# EasyEDA schematic SCH_CANSAT-M2-2026.json

## Sheets
1 Sensors: TITLE: Sensors; REV: 1.0; Date: 2026-02-06; Sheet: 1/1; Drawn By: Engineer162
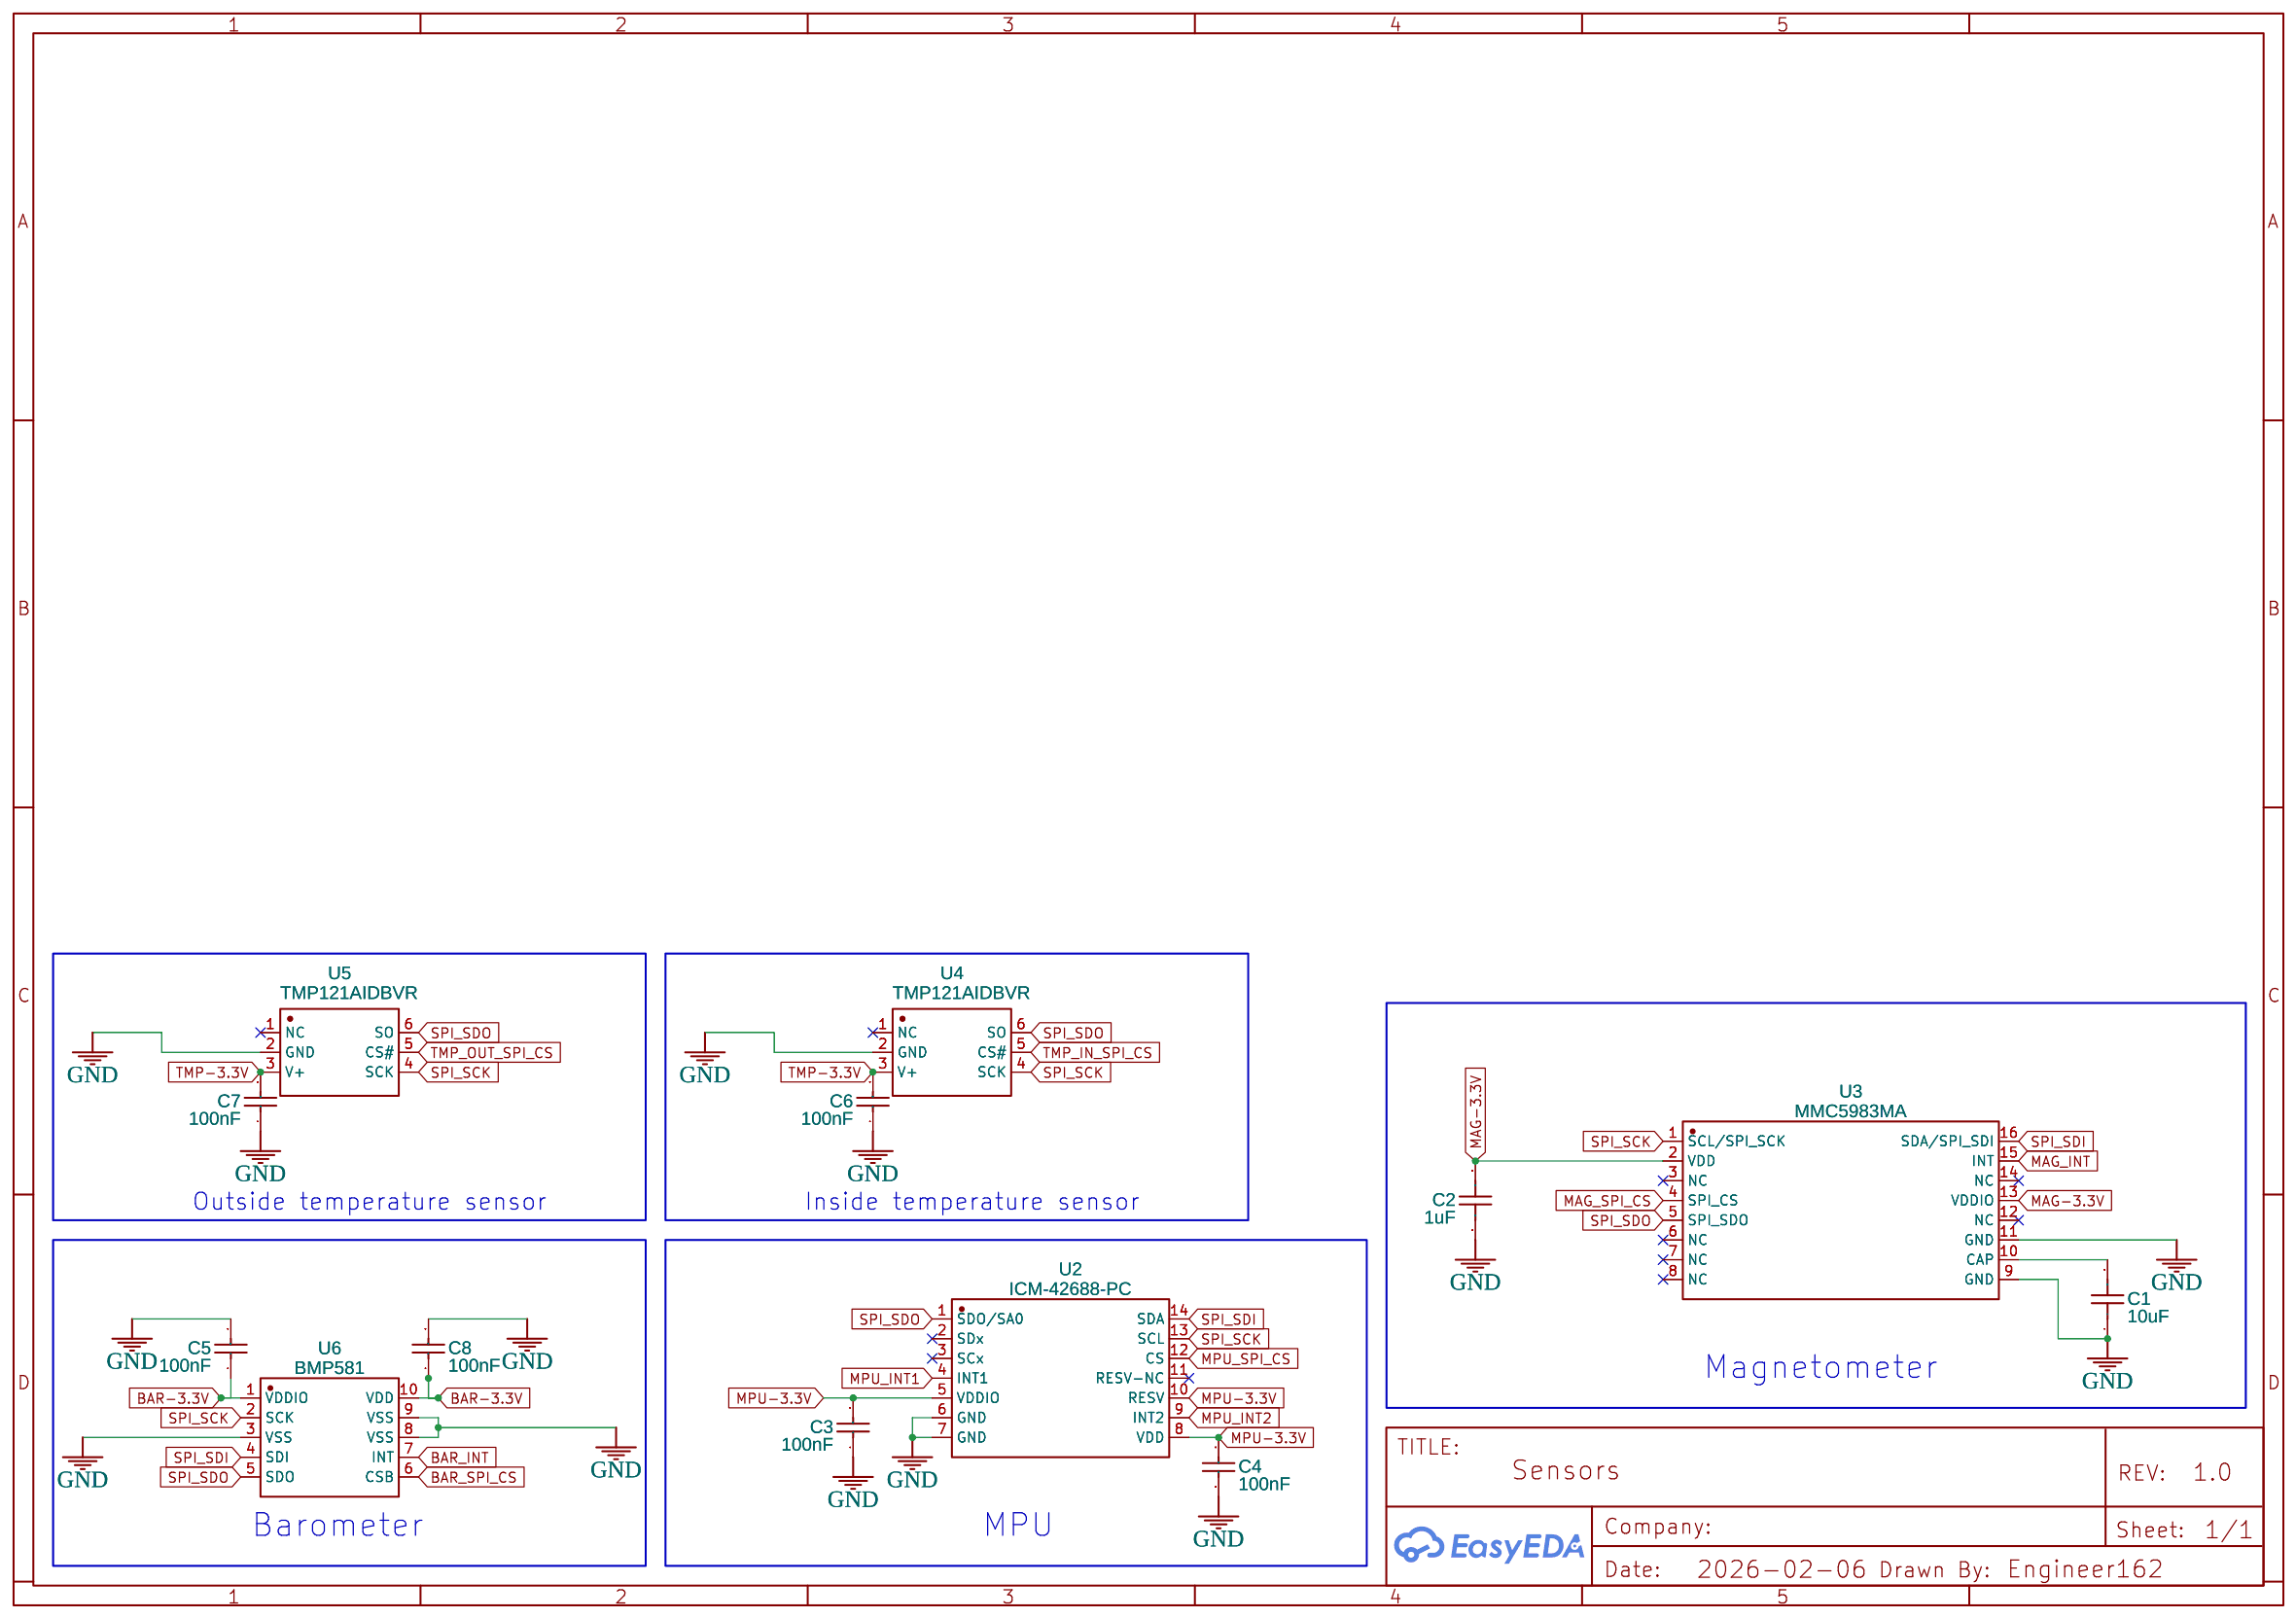
[diagram p0: Sensors]
2 Battery: TITLE: Battery
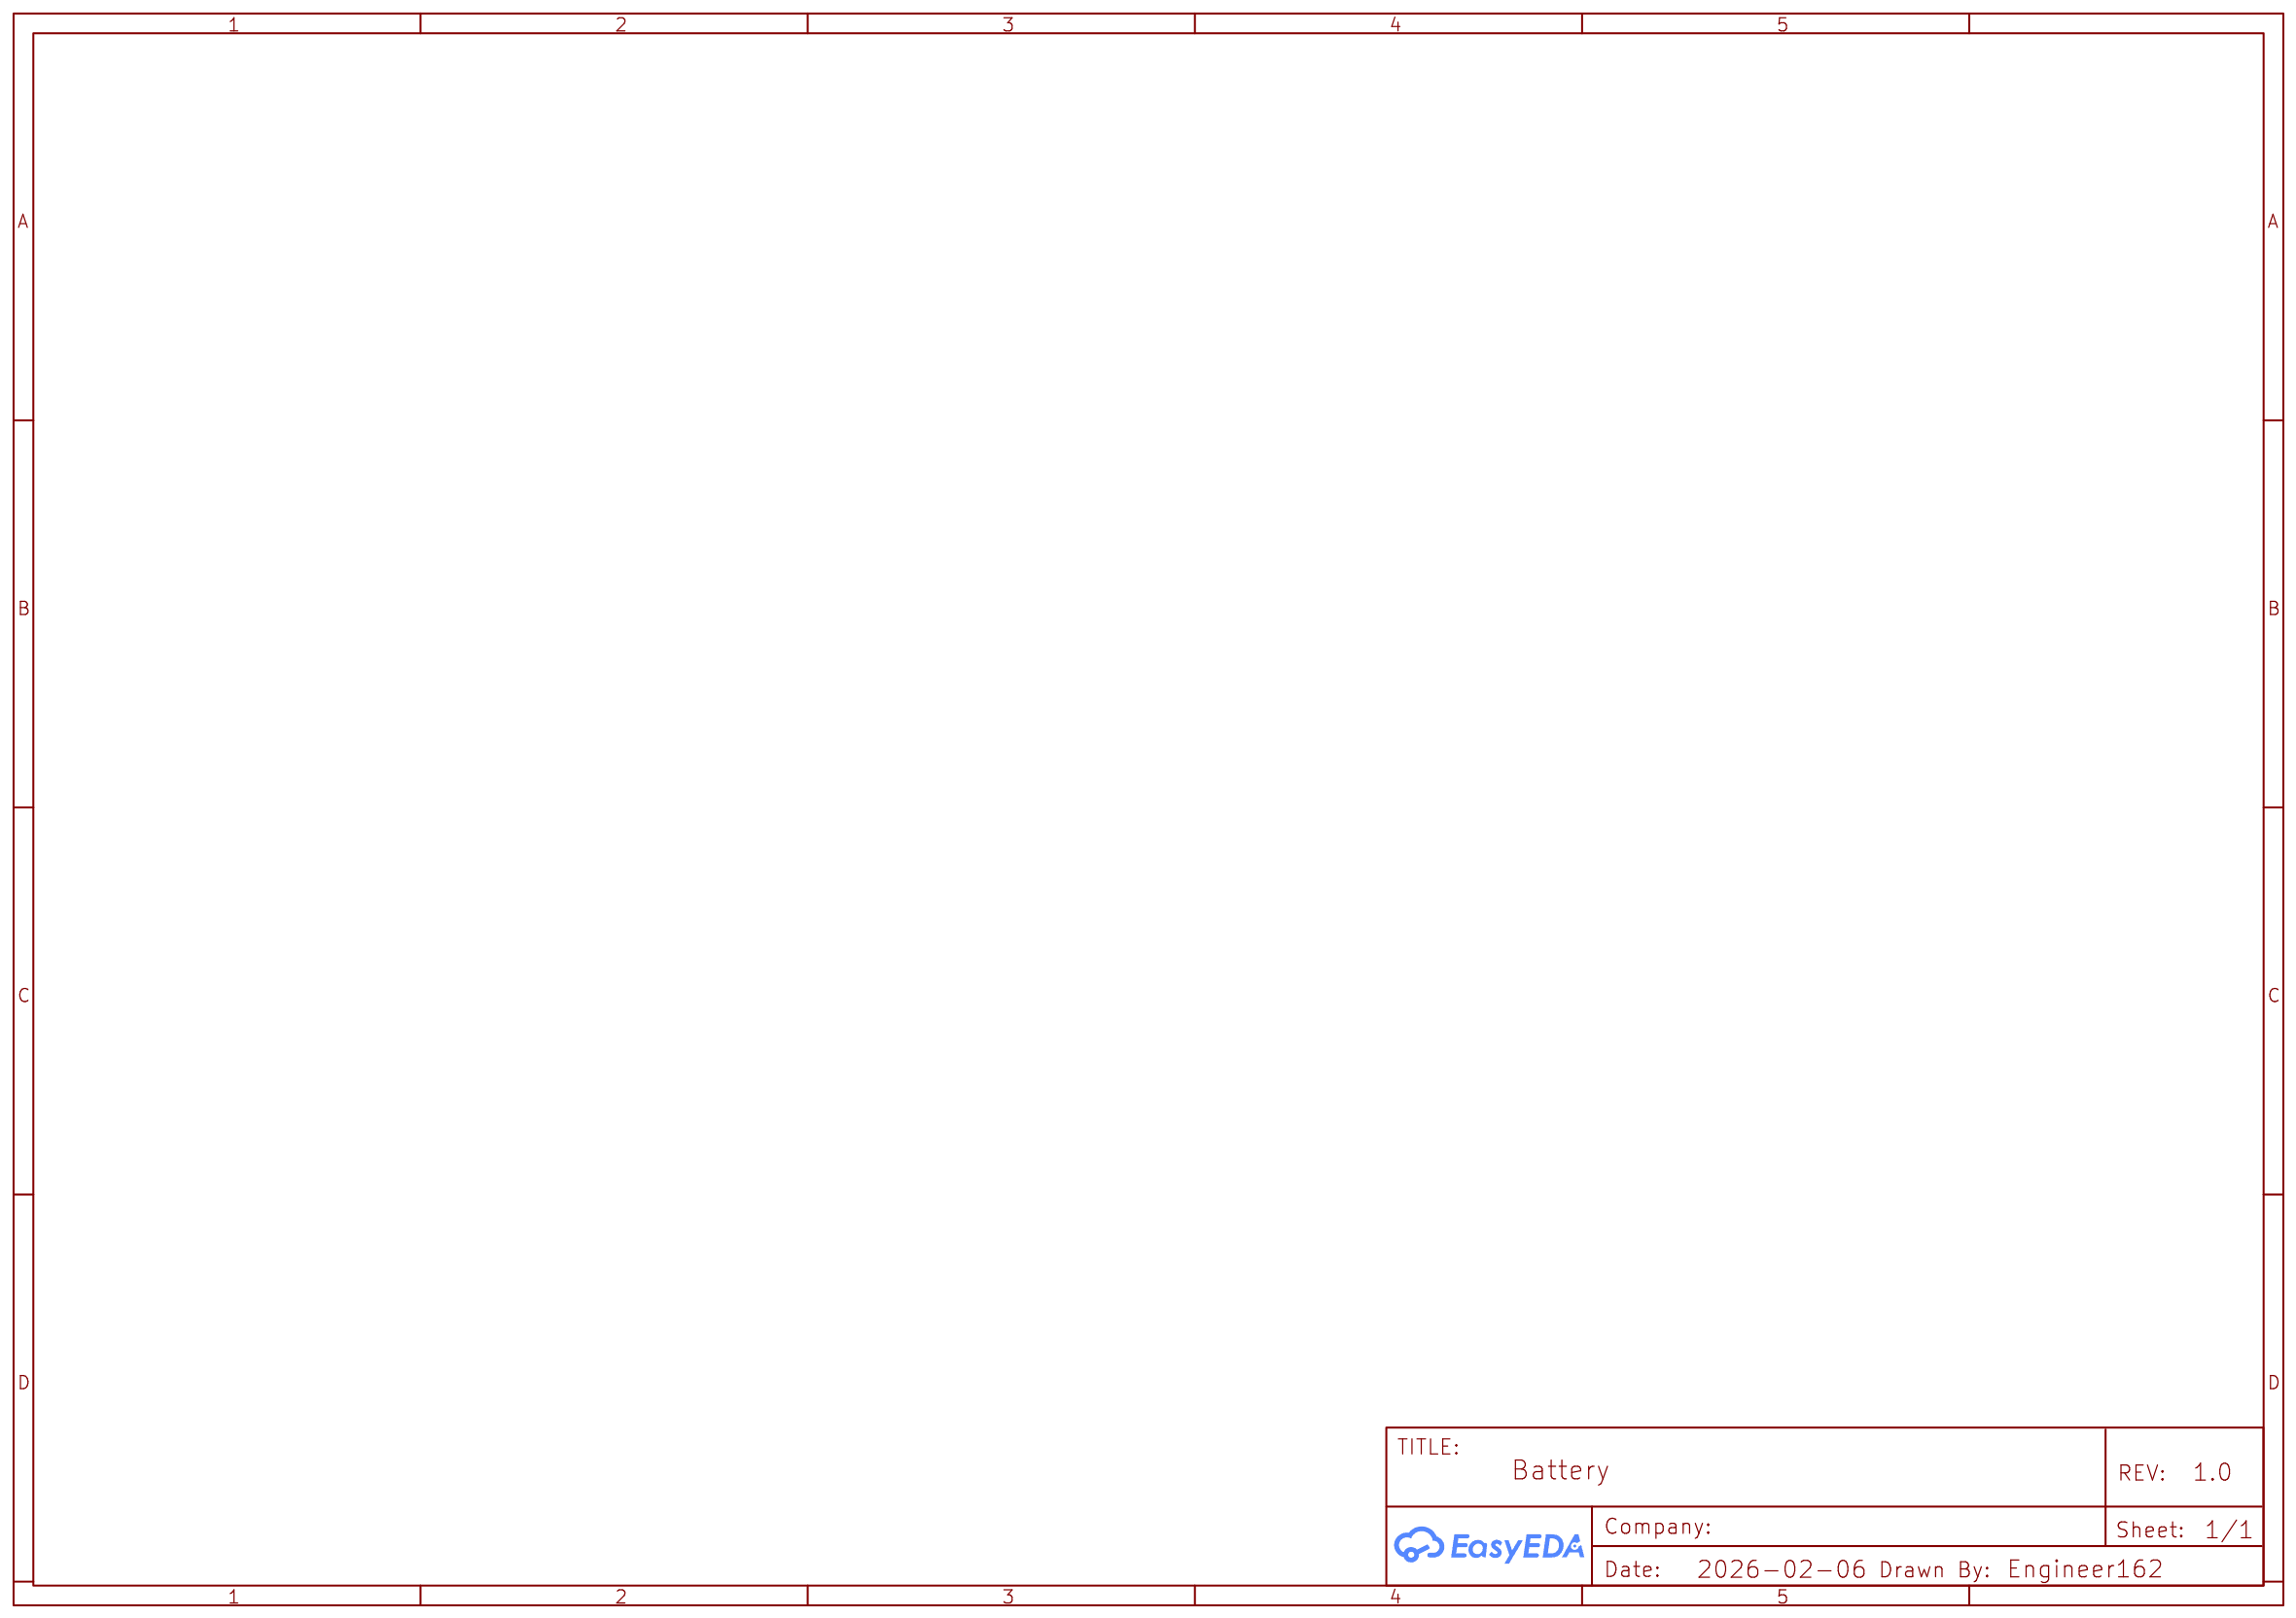
[diagram p1: Battery]
3 MCU: TITLE: MCU; Drawn By: hjalte; Company: Your Company
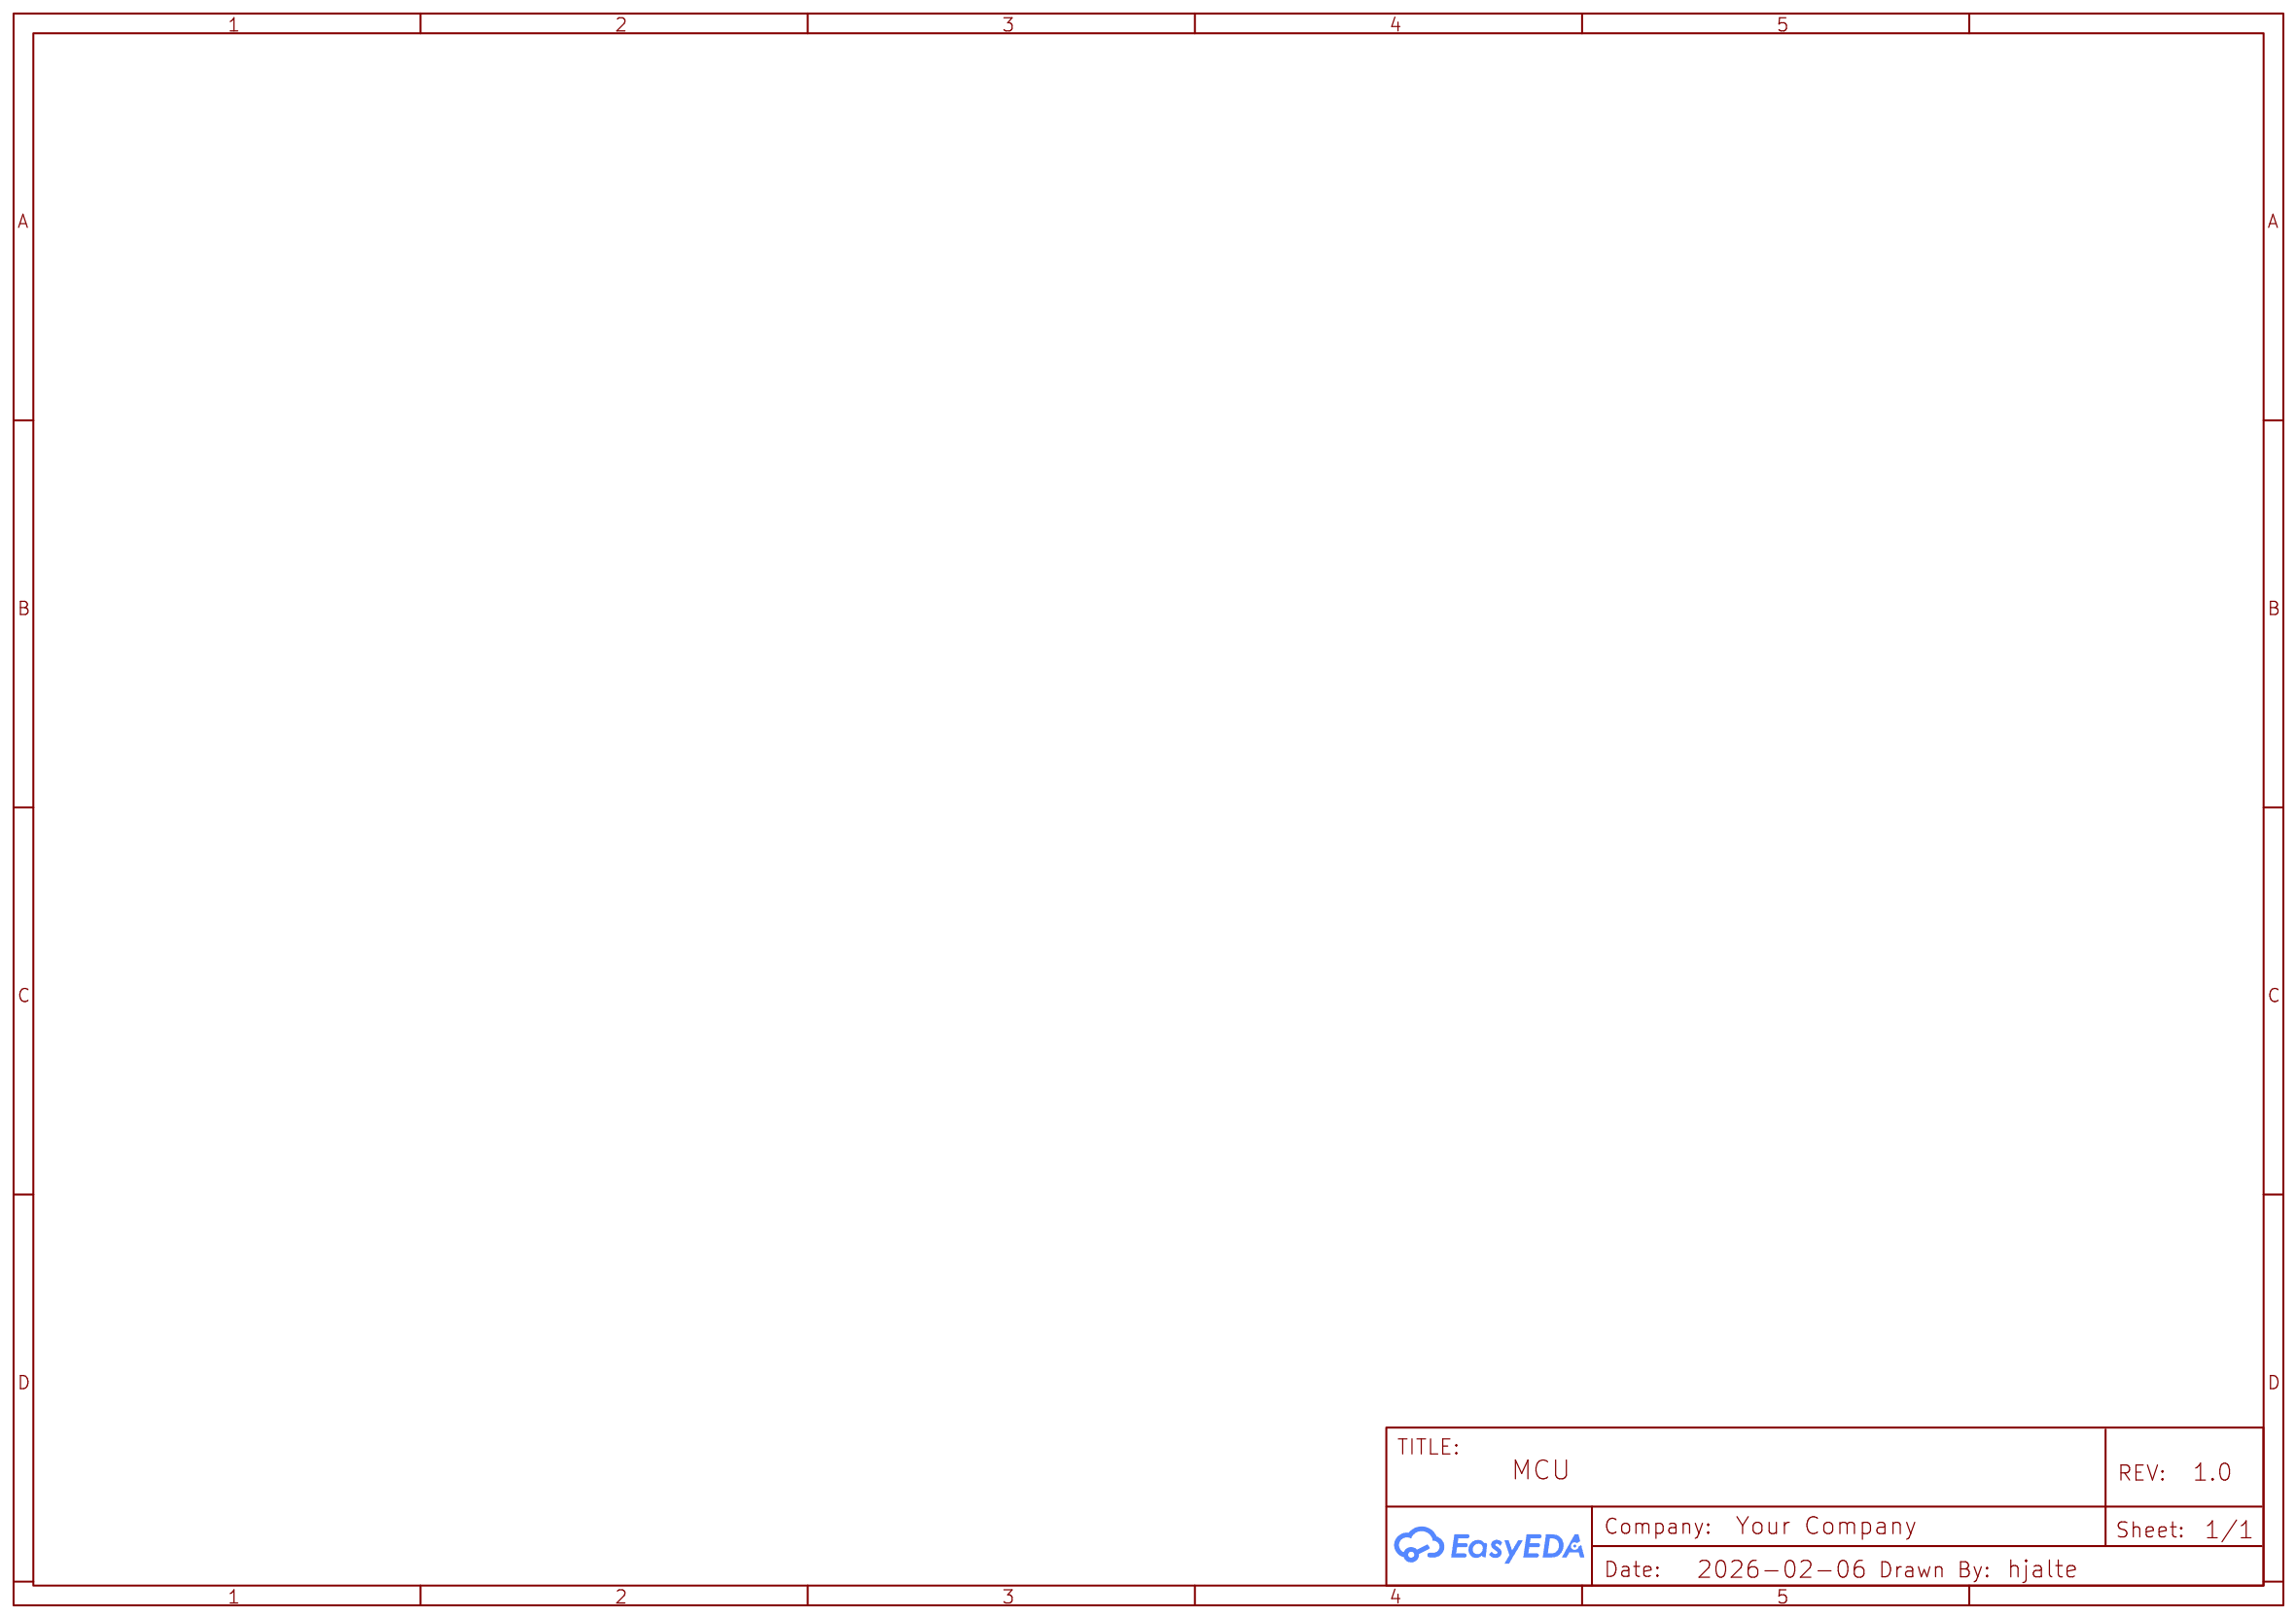
[diagram p2: MCU]

## Parts
C1  10uF  [C0805]
C2  1uF  [C0805]
C3  100nF  [C0603]
C4  100nF  [C0603]
C5  100nF  [C0603]
C6  100nF  [C0603]
C7  100nF  [C0603]
C8  100nF  [C0603]
U2  ICM-42688-PC  [LGA-14_L3.0-W2.5-P0.50-TL]
U3  MMC5983MA  [LGA-16_L3.0-W3.0-P0.50-BL_SQ]
U4  TMP121AIDBVR  [SOT-23-6_L2.9-W1.6-P0.95-LS2.8-BL]
U5  TMP121AIDBVR  [SOT-23-6_L2.9-W1.6-P0.95-LS2.8-BL]
U6  BMP581  [LGA-10_L2.0-W2.0-P0.50-TL_BMP581]

## Library data of the parts
C1 = C0805C106J8RACAUTO7210: Supplier: LCSC; Supplier Part: C2284609; Manufacturer: KEMET(基美); JLCPCB Part Class: Extended Part; Contributor: lcsc
C2 = CC0805JKX7R9BB105: Contributor: LCSC; Supplier: LCSC; Supplier Part: C541528; Manufacturer: YAGEO(国巨); JLCPCB Part Class: Extended Part
C3-C8 = CL10B104JB8NNNC: Supplier: LCSC; Manufacturer: SAMSUNG(三星); Supplier Part: C24452; JLCPCB Part Class: Extended Part
U2 = ICM-42688-PC: Supplier: LCSC; Supplier Part: C48586483; Manufacturer: Tokmas(托克马斯); Contributor: lcsc; JLCPCB Part Class: Extended Part
U3 = MMC5983MA: Contributor: LCSC; Supplier: LCSC; Supplier Part: C404329; Manufacturer: MEMSIC(美新); JLCPCB Part Class: Extended Part
U4 U5 = TMP121AIDBVR: Contributor: LCSC; Supplier: LCSC; Manufacturer: TI(德州仪器); Supplier Part: C133972; JLCPCB Part Class: Extended Part
U6 = BMP581: Supplier: LCSC; Supplier Part: C5362283; Manufacturer: Bosch(博世); JLCPCB Part Class: Extended Part; Contributor: lcsc

## Nets
GND: C1.1 C2.1 C3.1 C4.1 C5.2 C6.1 C7.1 C8.2 U2.6(GND) U2.7(GND) U3.9(GND) U3.11(GND) U4.2(GND) U5.2(GND) U6.3(VSS) U6.8(VSS) U6.9(VSS)
BAR-3.3V: C5.1 C8.1 U6.1(VDDIO) U6.10(VDD)
BAR_INT: U6.7(INT)
BAR_SPI_CS: U6.6(CSB)
MAG-3.3V: C2.2 U3.2(VDD) U3.13(VDDIO)
MAG_INT: U3.15(INT)
MAG_SPI_CS: U3.4(SPI_CS)
MPU-3.3V: C3.2 C4.2 U2.5(VDDIO) U2.8(VDD) U2.10(RESV)
MPU_INT1: U2.4(INT1)
MPU_INT2: U2.9(INT2)
MPU_SPI_CS: U2.12(CS)
SPI_SCK: U2.13(SCL) U3.1(SCL/SPI_SCK) U4.4(SCK) U5.4(SCK) U6.2(SCK)
SPI_SDI: U2.14(SDA) U3.16(SDA/SPI_SDI) U6.4(SDI)
SPI_SDO: U2.1(SDO/SA0) U3.5(SPI_SDO) U4.6(SO) U5.6(SO) U6.5(SDO)
TMP-3.3V: C6.2 C7.2 U4.3(V+) U5.3(V+)
TMP_IN_SPI_CS: U4.5(CS#)
TMP_OUT_SPI_CS: U5.5(CS#)
Net-(C1-2): C1.2 U3.10(CAP)

Not connected (* = marked no-connect by the designer): U2 2(SDx)* 3(SCx)* 11(RESV-NC)*; U3 3(NC)* 6(NC)* 7(NC)* 8(NC)* 12(NC)* 14(NC)*; U4 1(NC)*; U5 1(NC)*

## Notes on the sheets
sheet 1
- Outside temperature sensor
- Inside temperature sensor
- Magnetometer
- Barometer
- MPU
